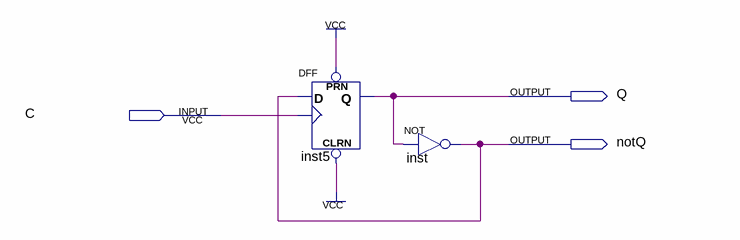
[diagram p0: schematic sheet]
// Quartus schematic Block1.bdf as structural Verilog: 2 symbols, 3 pins
module Block1 (
  input  C,
  output Q,
  output notQ
);

  DFF inst5 (.CLRN(1'b1), .CLK(C), .D(notQ), .PRN(1'b1), .Q(Q));
  not inst (notQ, Q);
endmodule
